# EAGLE schematic mainFinal (EAGLE 9.2.2)
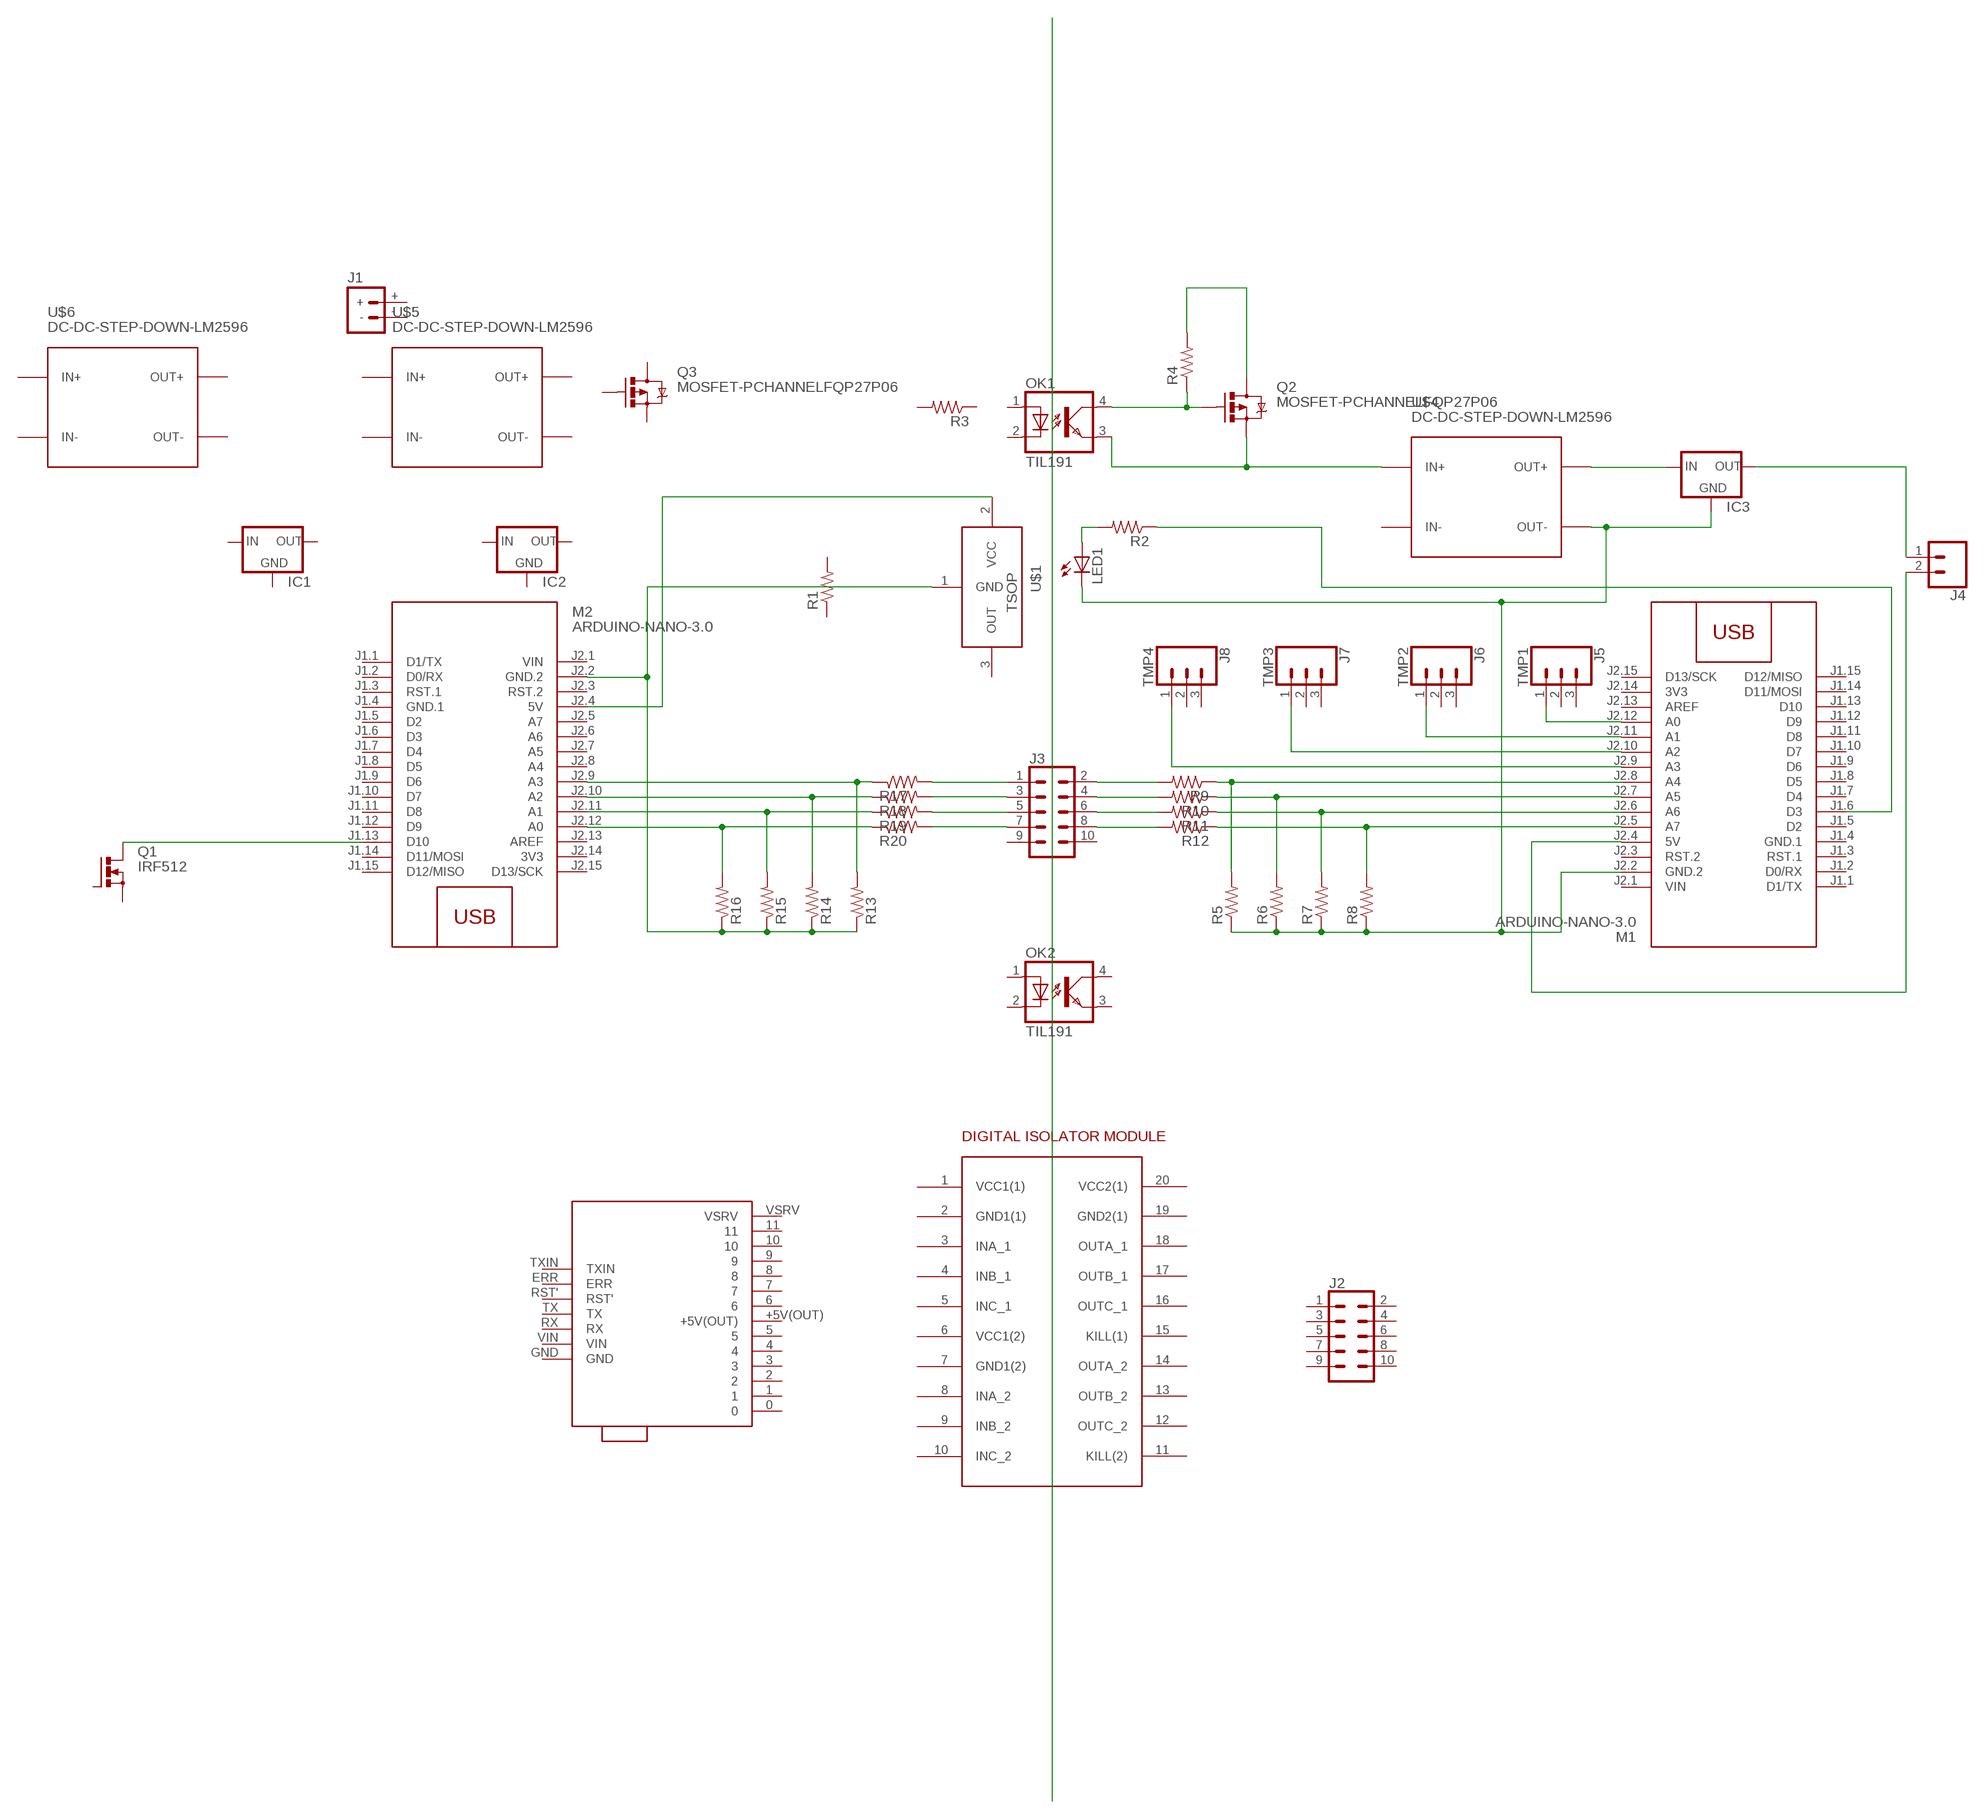
[diagram p0: schematic, sheet 1]

## Parts
IC1  78XXS  [78XXS]
IC2  78XXS  [78XXS]
IC3  78XXS  [78XXS]
J1  BATTERY_CONN_DEANS  [DEANS]
J2  CONN_05X2SHD_LOCK  [2X5-SHROUDED_LOCK]
J3  CONN_05X2SHD_LOCK  [2X5-SHROUDED_LOCK]
J4  CONN_02  [1X02]
J5  TMP1  CONN_03  [1X03]
J6  TMP2  CONN_03  [1X03]
J7  TMP3  CONN_03  [1X03]
J8  TMP4  CONN_03  [1X03]
LED1  LED3MM  [LED3MM]
M1  ARDUINO-NANO-3.0  [ARDUINO-NANO-3.0]
M2  ARDUINO-NANO-3.0  [ARDUINO-NANO-3.0]
OK1  TIL191  [DIL04]
OK2  TIL191  [DIL04]
Q1  IRF512  [TO220BV]
Q2  MOSFET-PCHANNELFQP27P06  [TO220V]
Q3  MOSFET-PCHANNELFQP27P06  [TO220V]
R1  R-US_0204/7  [0204/7]
R2  R-US_0204/7  [0204/7]
R3  R-US_0204/7  [0204/7]
R4  R-US_0204/7  [0204/7]
R5  R-US_0204/7  [0204/7]
R6  R-US_0204/7  [0204/7]
R7  R-US_0204/7  [0204/7]
R8  R-US_0204/7  [0204/7]
R9  R-US_0204/7  [0204/7]
R10  R-US_0204/7  [0204/7]
R11  R-US_0204/7  [0204/7]
R12  R-US_0204/7  [0204/7]
R13  R-US_0204/7  [0204/7]
R14  R-US_0204/7  [0204/7]
R15  R-US_0204/7  [0204/7]
R16  R-US_0204/7  [0204/7]
R17  R-US_0204/7  [0204/7]
R18  R-US_0204/7  [0204/7]
R19  R-US_0204/7  [0204/7]
R20  R-US_0204/7  [0204/7]
U$1  TSOP34X  [TSOP3XXX]
U$2  DIGITAL_ISOLATOR  [DIGITAL_ISOLATOR_MODULE]
U$3  SERVO_CONTROLLER  [SERVO_CONTROLLER]
U$4  DC-DC-STEP-DOWN-LM2596  [DC-DC-STEP-DOWN-LM2596]
U$5  DC-DC-STEP-DOWN-LM2596  [DC-DC-STEP-DOWN-LM2596]
U$6  DC-DC-STEP-DOWN-LM2596  [DC-DC-STEP-DOWN-LM2596]

## Nets
N$2: OK1.4(COL) Q2.1(G) R4.1
N$3: Q2.2(D) R4.2
N$4: OK1.3(EMIT) Q2.3(S) U$4.IN+
N$5: IC3.IN U$4.OUT+
N$6: IC3.GND LED1.K(C) M1.J2.2(GND.2) R5.1 R6.1 R7.1 R8.1 U$4.OUT-
N$7: J4.2 M1.J2.4(5V)
N$8: IC3.OUT J4.1
N$9: J5.1 M1.J2.12(A0)
N$10: J6.1 M1.J2.11(A1)
N$11: J7.1 M1.J2.10(A2)
N$12: J8.1 M1.J2.9(A3)
N$13: M1.J2.8(A4) R5.2 R9.1
N$14: M1.J2.7(A5) R6.2 R10.1
N$15: M1.J2.6(A6) R7.2 R11.1
N$16: M1.J2.5(A7) R8.2 R12.1
N$17: J3.1 R17.2
N$18: J3.2 R9.2
N$19: J3.4 R10.2
N$20: J3.6 R11.2
N$21: J3.8 R12.2
N$22: LED1.A R2.2
N$23: J3.3 R18.2
N$24: M1.J1.6(D3) R2.1
N$25: M2.J2.2(GND.2) R13.1 R14.1 R15.1 R16.1 U$1.1(GND)
N$26: M2.J2.9(A3) R13.2 R17.1
N$27: M2.J2.10(A2) R14.2 R18.1
N$28: M2.J2.11(A1) R15.2 R19.1
N$29: M2.J2.12(A0) R16.2 R20.1
N$30: J3.5 R19.2
N$31: J3.7 R20.2
N$32: M2.J1.13(D10) Q1.D
N$33: M2.J2.4(5V) U$1.2(VCC)
Unconnected: IC1.GND IC1.IN IC1.OUT IC2.GND IC2.IN IC2.OUT J1.+ J1.- J2.1 J2.2 J2.3 J2.4 J2.5 J2.6 J2.7 J2.8 J2.9 J2.10 J3.9 J3.10 J5.2 J5.3 J6.2 J6.3 J7.2 J7.3 J8.2 J8.3 M1.J1.1(D1/TX) M1.J1.2(D0/RX) M1.J1.3(RST.1) M1.J1.5(D2) M1.J1.7(D4) M1.J1.8(D5) M1.J1.9(D6) M1.J1.10(D7) M1.J1.11(D8) M1.J1.12(D9) M1.J1.13(D10) M1.J1.14(D11/MOSI) M1.J1.15(D12/MISO) M1.J2.3(RST.2) M1.J2.13(AREF) M1.J2.15(D13/SCK) M2.J1.1(D1/TX) M2.J1.2(D0/RX) M2.J1.3(RST.1) M2.J1.5(D2) M2.J1.6(D3) M2.J1.7(D4) M2.J1.8(D5) M2.J1.9(D6) M2.J1.10(D7) M2.J1.11(D8) M2.J1.12(D9) M2.J1.14(D11/MOSI) M2.J1.15(D12/MISO) M2.J2.3(RST.2) M2.J2.5(A7) M2.J2.6(A6) M2.J2.7(A5) M2.J2.8(A4) M2.J2.13(AREF) M2.J2.15(D13/SCK) OK1.1(A) OK1.2(C) OK2.1(A) OK2.2(C) OK2.3(EMIT) OK2.4(COL) Q1.G Q1.S Q3.1(G) Q3.2(D) Q3.3(S) R1.1 R1.2 R3.1 R3.2 U$1.3(OUT) U$2.1(VCC1(1)) U$2.2(GND1(1)) U$2.3(INA_1) U$2.4(INB_1) U$2.5(INC_1) U$2.6(VCC1(2)) U$2.7(GND1(2)) U$2.8(INA_2) U$2.9(INB_2) U$2.10(INC_2) U$2.11(KILL(2)) U$2.12(OUTC_2) U$2.13(OUTB_2) U$2.14(OUTA_2) U$2.15(KILL(1)) U$2.16(OUTC_1) U$2.17(OUTB_1) U$2.18(OUTA_1) U$2.19(GND2(1)) U$2.20(VCC2(1)) U$3.0 U$3.1 U$3.2 U$3.3 U$3.4 U$3.5 U$3.6 U$3.7 U$3.8 U$3.9 U$3.10 U$3.11 U$3.+5V(OUT) U$3.ERR U$3.GND U$3.RST' U$3.RX U$3.TX U$3.TXIN U$3.VIN U$3.VSRV U$4.IN- U$5.IN+ U$5.IN- U$5.OUT+ U$5.OUT- U$6.IN+ U$6.IN- U$6.OUT+ U$6.OUT-

## Power pins joined to a net without a drawn wire
3V3: M1.J2.14(3V3) M2.J2.14(3V3)
GND.1: M1.J1.4(GND.1) M2.J1.4(GND.1)
VIN: M1.J2.1(VIN) M2.J2.1(VIN)

## Library data of the parts
IC1-IC3 = v-reg:78XXS: VOLTAGE REGULATOR
J1 = SparkFun-Connectors:BATTERY_CONN: Battery Connectors Various footprints for battery connections SparkFun Products: Deans Connector -M/F Pair <https://www.sparkfun.com/products/11864>; SF_ID: PRT-11864
J2 J3 = SparkFun-Connectors:CONN_05X2: Multi connection point. Often used as Generic Header-pin footprint for 0.1 inch spaced/style header connections For AVR SPI programming port, see special device with nice symbol: "AVR_SPI_PROG_5x2.dev" You can populate with any combo of single row headers, but if you'd like an exact match, check these: 2x5 AVR ICSP Male Header <https://www.sparkfun.com/products/778> (PRT-00778) 2x5 Pin Shrouded Header <https://www.sparkfun.com/products/8506> (PRT-08506) On any of the 0.1 inch spaced packages, you can populate with these: Break Away Headers - Straight <https://www.sparkfun.com/products/116> (PRT-00116) Break Away Male Headers - Right Angle <https://www.sparkfun.com/products/553> (PRT-00553) Female Headers <https://www.sparkfun.com/products/115> (PRT-00115) Break Away Headers - Machine Pin <https://www.sparkfun.com/products/117> (PRT-00117) Break Away Female Headers - Swiss Machine Pin <https://www.sparkfun.com/products/743> (PRT-00743) Special note: the shrouded connector mates well with our 5x2 ribbon cables: 2x5 Pin IDC Ribbon Cable <https://www.sparkfun.com/products/8535> (PRT-08535); PROD_ID: CONN-08671; SF_ID: PRT-08506
J4 = SparkFun-Connectors:CONN_02: Multi connection point. Often used as Generic Header-pin footprint for 0.1 inch spaced/style header connections On any of the 0.1 inch spaced packages, you can populate with these: Break Away Headers - Straight <https://www.sparkfun.com/products/116> (PRT-00116) Break Away Male Headers - Right Angle <https://www.sparkfun.com/products/553> (PRT-00553) Female Headers <https://www.sparkfun.com/products/115> (PRT-00115) Break Away Headers - Machine Pin <https://www.sparkfun.com/products/117> (PRT-00117) Break Away Female Headers - Swiss Machine Pin <https://www.sparkfun.com/products/743> (PRT-00743) For SCREWTERMINALS and SPRING TERMINALS visit here: Screw Terimnals on SparkFun.com <https://www.sparkfun.com/search/results?term=Screw+Terminals> (5mm/3.5mm/2.54mm spacing) This device is also useful as a general connection point to wire up your design to another part of your project. Our various solder wires solder well into these plated through hole pads. Hook-Up Wire - Assortment (Stranded, 22 AWG) <https://www.sparkfun.com/products/11375> (PRT-11375) Hook-Up Wire - Assortment (Solid Core, 22 AWG) <https://www.sparkfun.com/products/11367> (PRT-11367) View the entire wire category on our website here <https://www.sparkfun.com/categories/141> Special notes: Molex polarized connector foot print use with: PRT-08233 with associated crimp pins and housings. 2.54_SCREWTERM for use with PRT-10571. 3.5mm Screw Terminal footprints for PRT-08084 5mm Screw Terminal footprints for use with PRT-08432
J5-J8 = SparkFun-Connectors:CONN_03: Multi connection point. Often used as Generic Header-pin footprint for 0.1 inch spaced/style header connections On any of the 0.1 inch spaced packages, you can populate with these: Break Away Headers - Straight <https://www.sparkfun.com/products/116> (PRT-00116) Break Away Male Headers - Right Angle <https://www.sparkfun.com/products/553> (PRT-00553) Female Headers <https://www.sparkfun.com/products/115> (PRT-00115) Break Away Headers - Machine Pin <https://www.sparkfun.com/products/117> (PRT-00117) Break Away Female Headers - Swiss Machine Pin <https://www.sparkfun.com/products/743> (PRT-00743) Stackable Header - 3 Pin (Female, 0.1") <https://www.sparkfun.com/products/13875> (PRT-13875) For SCREWTERMINALS and SPRING TERMINALS visit here: Screw Terimnals on SparkFun.com <https://www.sparkfun.com/search/results?term=Screw+Terminals> (5mm/3.5mm/2.54mm spacing) This device is also useful as a general connection point to wire up your design to another part of your project. Our various solder wires solder well into these plated through hole pads. Hook-Up Wire - Assortment (Stranded, 22 AWG) <https://www.sparkfun.com/products/11375> (PRT-11375) Hook-Up Wire - Assortment (Solid Core, 22 AWG) <https://www.sparkfun.com/products/11367> (PRT-11367) View the entire wire category on our website here <https://www.sparkfun.com/categories/141> Special notes: Molex polarized connector foot print use with SKU : PRT-08232 with associated crimp pins and housings.; PROD_ID: XXX-00000; VALUE: 455-1750-1-ND
LED1 = CEDT_JANUARY_2015_v5:LED
M1 M2 = diy-modules:ARDUINO-NANO-3.0: Arduino Nano 3.0 and compatible devices More details available here: https://www.arduino.cc/en/Main/ArduinoBoardNano Click here to find device on ebay.com <http://www.ebay.com/sch/arduino+nano>
OK1 OK2 = optocoupler:TIL191: TEXAS INSTRUMENTS OPTO COUPLER; OC_FARNELL: 1683363; OC_NEWARK: unknown
Q1 = transistor-power:IRF512: N-CHANNEL MOS FET
Q2 Q3 = SparkFun-DiscreteSemi:MOSFET-PCHANNEL: Generic PMOSFET IRLML2244 - TRANS-11153 (SOT-23 -20V -4.3A) (1.Gate 2.Source 3.Drain) FQP27P06 - COM-10349 <http://www.sparkfun.com/products/10349> (TO-220 -60V -27A) (1.Gate 2.Source 3.Drain)
R1-R20 = rcl:R-US_: RESISTOR, American symbol; SPICEPREFIX: R
U$1 = CEDT_JANUARY_2015_v5:TSOP34X: Vishay IR Reciever Product Page <http://www.vishay.com/product?docid=82489> Family -TSOP34XX Part by : Rohit Gupta
U$2 = ISO7330C DIGITAL ISOLATOR MODULE:DIGITAL_ISOLATOR
U$3 = Servo Controller:SERVO_CONTROLLER
U$4-U$6 = diy-modules:DC-DC-STEP-DOWN-LM2596: DC/DC Step-Down Regulator based on LM2596-ADJ chip LM2596 datasheet available here: http://www.ti.com/lit/ds/symlink/lm2596.pdf Click here to find device on ebay.com <http://www.ebay.com/sch/lm2596+power+regulator>